# Altium project z80.PrjPcb
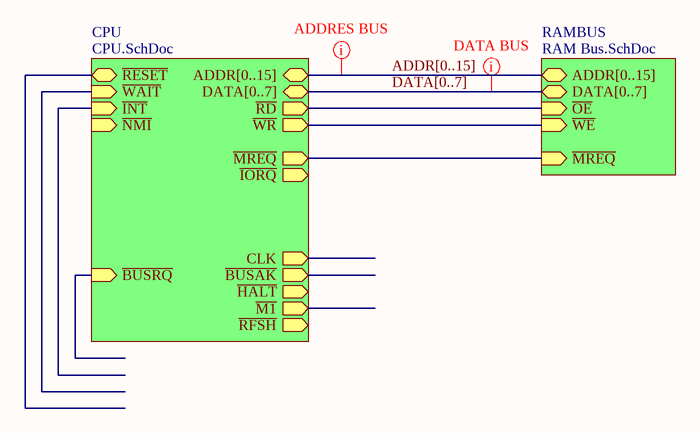
[diagram p0: main.SchDoc]
4 sheets, 54 parts. Net scope: hierarchical (ports join the sheet entries above them; power ports are global).
Board file: revA.PcbDoc
Sheets:
  main.SchDoc
    CPU = CPU.SchDoc
    RAMBUS = RAM Bus.SchDoc
      RAM = RAM.SchDoc
      RAM = RAM.SchDoc
      RAM = RAM.SchDoc
      RAM = RAM.SchDoc
      RAM = RAM.SchDoc
      RAM = RAM.SchDoc
      RAM = RAM.SchDoc
      RAM = RAM.SchDoc

## Sheet main.SchDoc
size A4; SheetNumber: 1

### Sub-sheets
CPU = CPU.SchDoc: ADDR[0..15] (bidir), DATA[0..7] (bidir), ~{M1} (out), ~{MREQ} (out), ~{IORQ} (out), ~{RD} (out), ~{WR} (out), ~{RFSH} (out), ~{WAIT} (in), ~{INT} (in), ~{BUSRQ} (in), ~{BUSAK} (out), ~{NMI} (in), ~{RESET} (bidir), ~{HALT} (out), CLK (out)
RAMBUS = RAM Bus.SchDoc: ~{OE} (in), ~{WE} (in), DATA[0..7] (bidir), ADDR[0..15] (bidir), ~{MREQ} (in)

### Nets
~{MREQ}: sheet CPU/~{MREQ}, sheet RAMBUS/~{MREQ}
~{RD}: sheet CPU/~{RD}, sheet RAMBUS/~{OE}
~{WR}: sheet CPU/~{WR}, sheet RAMBUS/~{WE}

### Buses and harness runs
bus ADDR[0..15] = sheet CPU/ADDR[0..15] = sheet RAMBUS/ADDR[0..15]
bus DATA[0..7] = sheet CPU/DATA[0..7] = sheet RAMBUS/DATA[0..7]

### Layout directives
net class ADDRES BUS: (no net found under the mark)
net class DATA BUS: (no net found under the mark)

## Sheet CPU.SchDoc
size A4; SheetNumber: 2
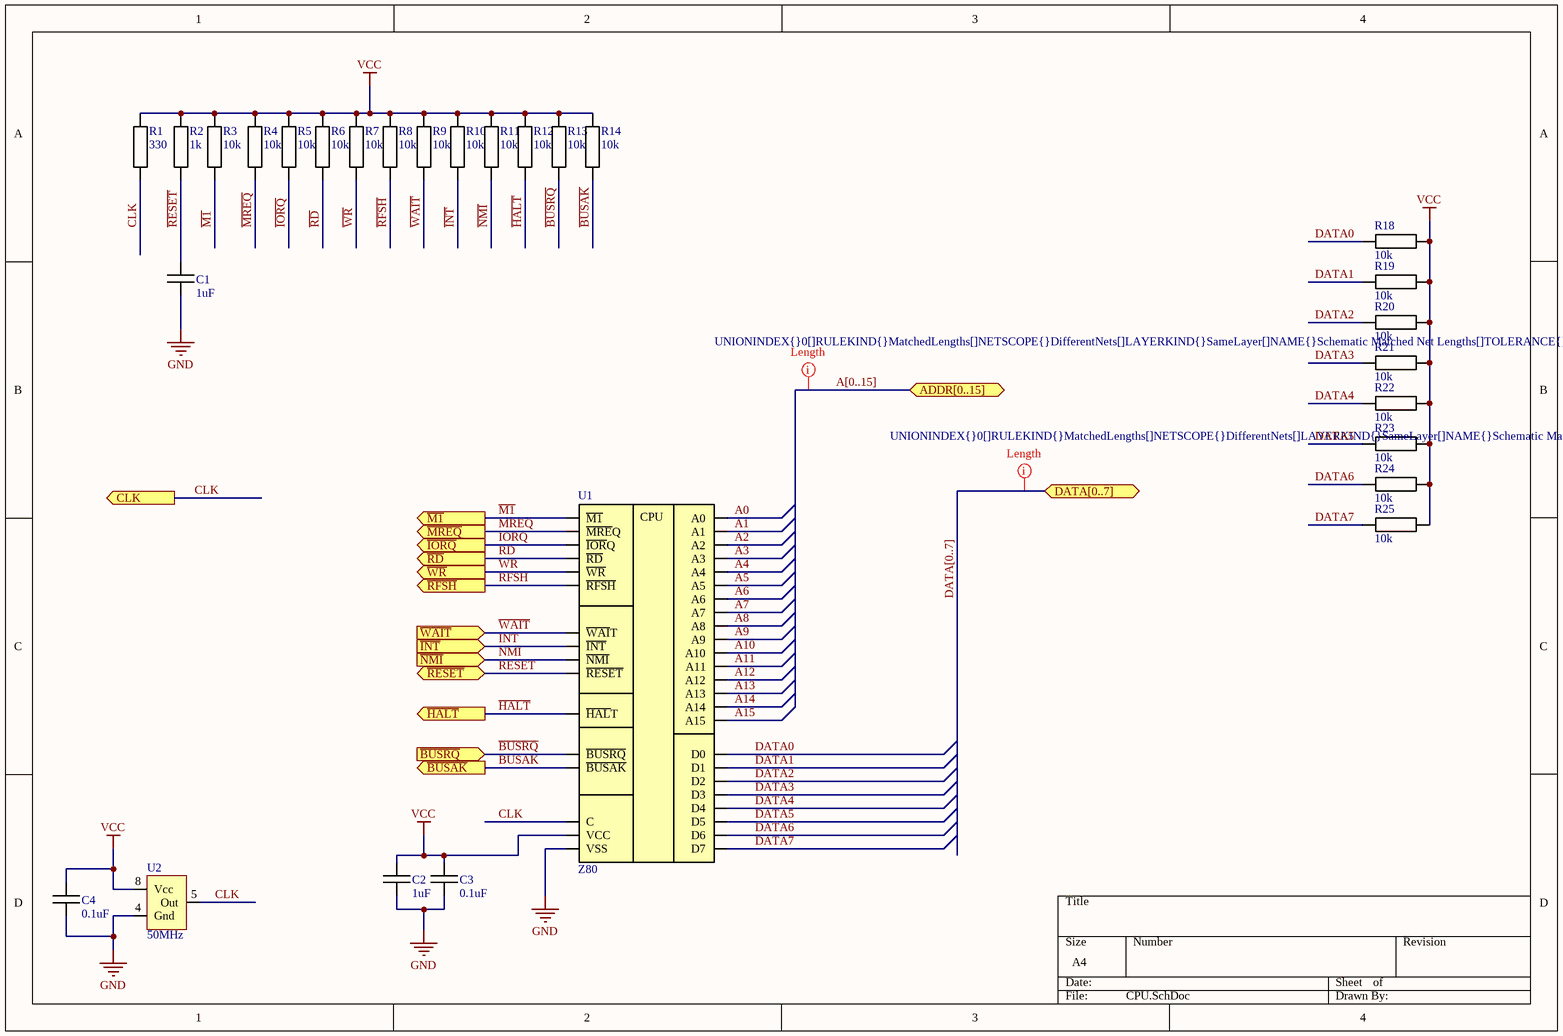
[diagram p1: CPU.SchDoc]

### Parts
C1  1uF  [SMD 0603]
C2  1uF  [SMD 0603]
C3  0.1uF  [SMD 0603]
C4  0.1uF  [SMD 0603]
R1  330  [SMD 0603]
R2  1k  [SMD 0603]
R3  10k  [SMD 0603]
R4  10k  [SMD 0603]
R5  10k  [SMD 0603]
R6  10k  [SMD 0603]
R7  10k  [SMD 0603]
R8  10k  [SMD 0603]
R9  10k  [SMD 0603]
R10  10k  [SMD 0603]
R11  10k  [SMD 0603]
R12  10k  [SMD 0603]
R13  10k  [SMD 0603]
R14  10k  [SMD 0603]
R18  10k  [SMD 0603]
R19  10k  [SMD 0603]
R20  10k  [SMD 0603]
R21  10k  [SMD 0603]
R22  10k  [SMD 0603]
R23  10k  [SMD 0603]
R24  10k  [SMD 0603]
R25  10k  [SMD 0603]
U1  Z80  [Z80]
U2  50MHz  [XTALL GEN]

### Ports
ADDR[0..15] (bidir), CLK (out), DATA[0..7] (bidir), ~{BUSAK} (out), ~{BUSRQ} (in), ~{HALT} (out), ~{INT} (in), ~{IORQ} (out), ~{M1} (out), ~{MREQ} (out), ~{NMI} (in), ~{RD} (out), ~{RESET} (bidir), ~{RFSH} (out), ~{WAIT} (in), ~{WR} (out)

### Nets
GND: C1.1 C2.1 C3.1 C4.1 U1.29(VSS) U2.4(Gnd)
VCC: C2.2 C3.2 C4.2 R1.2 R2.2 R3.2 R4.2 R5.2 R6.2 R7.2 R8.2 R9.2 R10.2 R11.2 R12.2 R13.2 R14.2 R18.2 R19.2 R20.2 R21.2 R22.2 R23.2 R24.2 R25.2 U1.11(VCC) U2.8(Vcc)
~{BUSAK}: R14.1 U1.23(~{BUSAK}) ; port ~{BUSAK}
~{BUSRQ}: R13.1 U1.25(~{BUSRQ}) ; port ~{BUSRQ}
~{HALT}: R12.1 U1.18(~{HAL}T) ; port ~{HALT}
~{INT}: R10.1 U1.16(~{INT}) ; port ~{INT}
~{IORQ}: R5.1 U1.20(~{IOR}Q) ; port ~{IORQ}
~{M1}: R3.1 U1.27(~{M1}) ; port ~{M1}
~{MREQ}: R4.1 U1.19(~{MRE}Q) ; port ~{MREQ}
~{NMI}: R11.1 U1.17(~{NMI}) ; port ~{NMI}
~{RD}: R6.1 U1.21(~{RD}) ; port ~{RD}
~{RESET}: C1.2 R2.1 U1.26(~{RESET}) ; port ~{RESET}
~{RFSH}: R8.1 U1.28(~{RFSH}) ; port ~{RFSH}
~{WAIT}: R9.1 U1.24(~{WAI}T) ; port ~{WAIT}
~{WR}: R7.1 U1.22(~{WR}) ; port ~{WR}
A0: U1.30(A0)  [project net ADDR0]
A1: U1.31(A1)  [project net ADDR1]
A2: U1.32(A2)  [project net ADDR2]
A3: U1.33(A3)  [project net ADDR3]
A4: U1.34(A4)  [project net ADDR4]
A5: U1.35(A5)  [project net ADDR5]
A6: U1.36(A6)  [project net ADDR6]
A7: U1.37(A7)  [project net ADDR7]
A8: U1.38(A8)  [project net ADDR8]
A9: U1.39(A9)  [project net ADDR9]
A10: U1.40(A10)  [project net ADDR10]
A11: U1.1(A11)  [project net ADDR11]
A12: U1.2(A12)  [project net ADDR12]
A13: U1.3(A13)  [project net ADDR13]
A14: U1.4(A14)  [project net ADDR14]
A15: U1.5(A15)  [project net ADDR15]
CLK: R1.1 U1.6(C) U2.5(Out) ; port CLK
DATA0: R18.1 U1.14(D0)
DATA1: R19.1 U1.15(D1)
DATA2: R20.1 U1.12(D2)
DATA3: R21.1 U1.8(D3)
DATA4: R22.1 U1.7(D4)
DATA5: R23.1 U1.9(D5)
DATA6: R24.1 U1.10(D6)
DATA7: R25.1 U1.13(D7)

### Buses and harness runs
bus A[0..15] = port ADDR[0..15]
bus DATA[0..7] = port DATA[0..7]

### Layout directives
rule Matched Net Lengths [Tolerance = 60mil]: (no net found under the mark)

### Notes on the sheet
- (in symbol Z80) CPU

### Library data of the parts
C1-C4 = Capasitor
  C1 C2: Value: 1uF
  C3 C4: Value: 0.1uF
R1-R14 R18-R25 = Resistor
  R1: Value: 330
  R2: Value: 1k
  R3-R14 R18-R25: Value: 10k
U1 = Z80: Zilog CPU
U2 = XTALL GEN: value: 50MHz

## Sheet RAM Bus.SchDoc
size A4; SheetNumber: 3
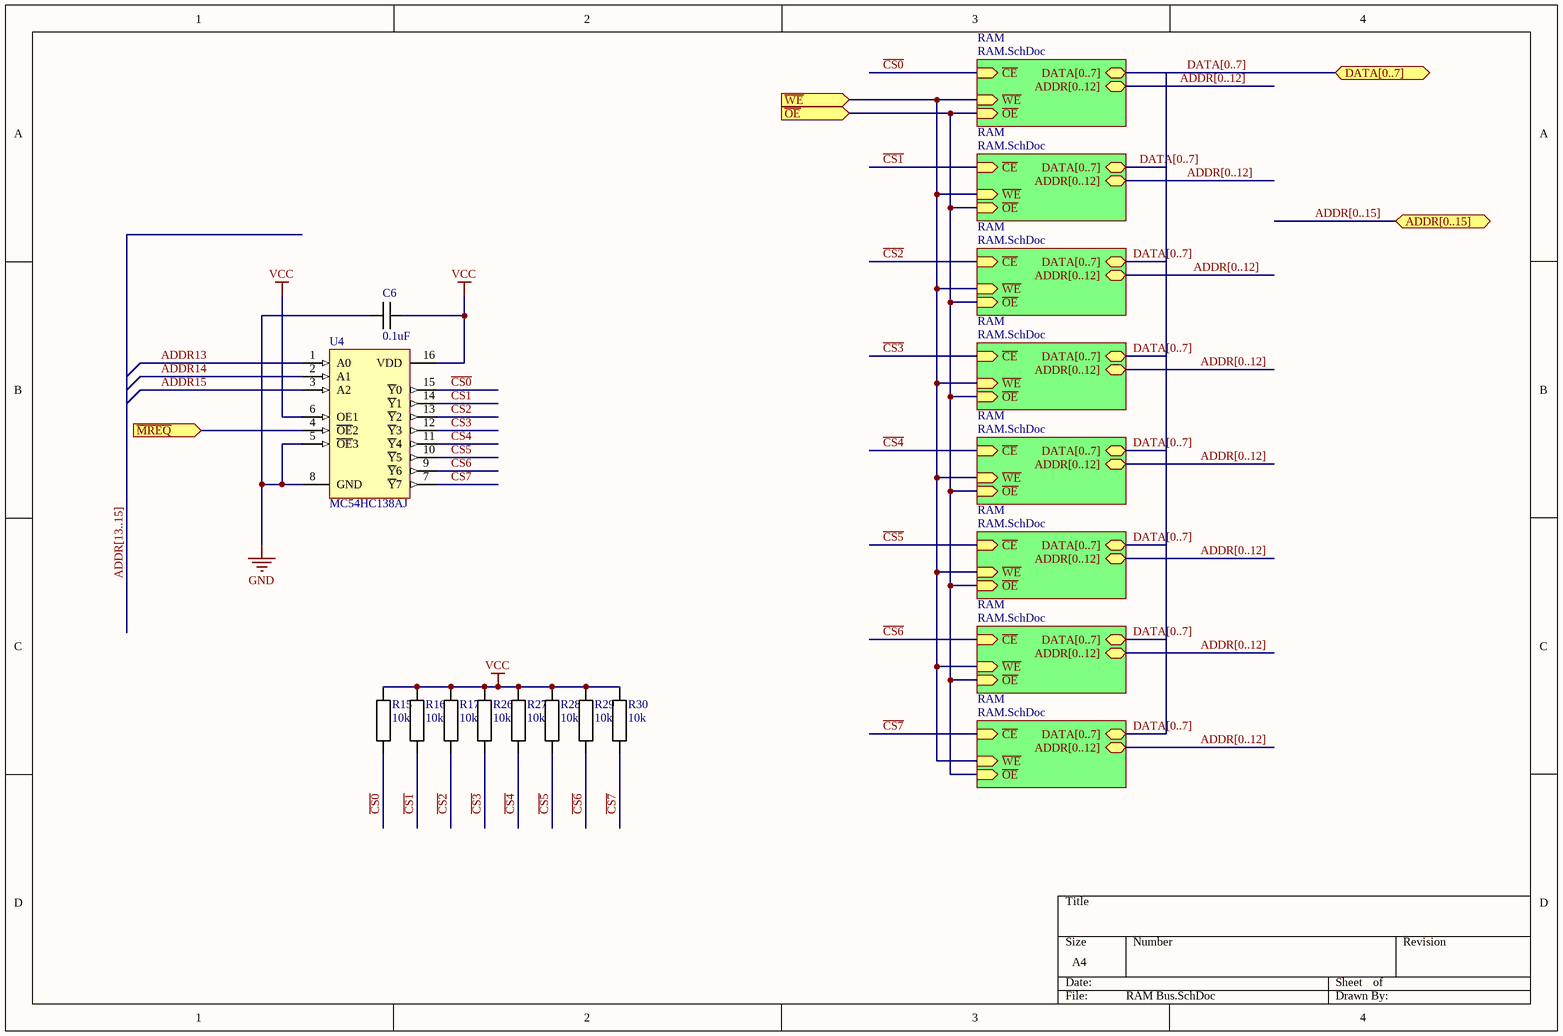
[diagram p2: RAM Bus.SchDoc]

### Parts
C6  0.1uF  [SMD 0603]
R15  10k  [SMD 0603]
R16  10k  [SMD 0603]
R17  10k  [SMD 0603]
R26  10k  [SMD 0603]
R27  10k  [SMD 0603]
R28  10k  [SMD 0603]
R29  10k  [SMD 0603]
R30  10k  [SMD 0603]
U4  MC54HC138AJ  [620-09]

### Sub-sheets
RAM = RAM.SchDoc: DATA[0..7] (bidir), ADDR[0..12] (bidir), ~{WE} (in), ~{CE} (in), ~{OE} (in)
RAM = RAM.SchDoc: DATA[0..7] (bidir), ADDR[0..12] (bidir), ~{WE} (in), ~{CE} (in), ~{OE} (in)
RAM = RAM.SchDoc: DATA[0..7] (bidir), ADDR[0..12] (bidir), ~{WE} (in), ~{CE} (in), ~{OE} (in)
RAM = RAM.SchDoc: DATA[0..7] (bidir), ADDR[0..12] (bidir), ~{WE} (in), ~{CE} (in), ~{OE} (in)
RAM = RAM.SchDoc: DATA[0..7] (bidir), ADDR[0..12] (bidir), ~{WE} (in), ~{CE} (in), ~{OE} (in)
RAM = RAM.SchDoc: DATA[0..7] (bidir), ADDR[0..12] (bidir), ~{WE} (in), ~{CE} (in), ~{OE} (in)
RAM = RAM.SchDoc: DATA[0..7] (bidir), ADDR[0..12] (bidir), ~{WE} (in), ~{CE} (in), ~{OE} (in)
RAM = RAM.SchDoc: DATA[0..7] (bidir), ADDR[0..12] (bidir), ~{WE} (in), ~{CE} (in), ~{OE} (in)

### Ports
ADDR[0..15] (bidir), DATA[0..7] (bidir), ~{MREQ} (in), ~{OE} (in), ~{WE} (in)

### Nets
GND: C6.1 U4.5(~{OE}3) U4.8(GND)
VCC: C6.2 R15.2 R16.2 R17.2 R26.2 R27.2 R28.2 R29.2 R30.2 U4.6(OE1) U4.16(VDD)
~{CS0}: R15.1 U4.15(~{Y}0) ; sheet RAM/~{CE}
~{CS1}: R16.1 U4.14(~{Y}1) ; sheet RAM/~{CE}
~{CS2}: R17.1 U4.13(~{Y}2) ; sheet RAM/~{CE}
~{CS3}: R26.1 U4.12(~{Y}3) ; sheet RAM/~{CE}
~{CS4}: R27.1 U4.11(~{Y}4) ; sheet RAM/~{CE}
~{CS5}: R28.1 U4.10(~{Y}5) ; sheet RAM/~{CE}
~{CS6}: R29.1 U4.9(~{Y}6) ; sheet RAM/~{CE}
~{CS7}: R30.1 U4.7(~{Y}7) ; sheet RAM/~{CE}
~{MREQ}: U4.4(~{OE}2) ; port ~{MREQ}
~{RD}: port ~{OE}, sheet RAM/~{OE}, sheet RAM/~{OE}, sheet RAM/~{OE}, sheet RAM/~{OE}, sheet RAM/~{OE}, sheet RAM/~{OE}, sheet RAM/~{OE}, sheet RAM/~{OE}
~{WR}: port ~{WE}, sheet RAM/~{WE}, sheet RAM/~{WE}, sheet RAM/~{WE}, sheet RAM/~{WE}, sheet RAM/~{WE}, sheet RAM/~{WE}, sheet RAM/~{WE}, sheet RAM/~{WE}
ADDR13: U4.1(A0)
ADDR14: U4.2(A1)
ADDR15: U4.3(A2)

### Buses and harness runs
bus ADDR[0..12] = sheet RAM/ADDR[0..12]
bus ADDR[0..15] = port ADDR[0..15]
bus ADDR[13..15]
bus DATA[0..7] = port DATA[0..7] = sheet RAM/DATA[0..7]

### Library data of the parts
C6 = Capasitor: Value: 0.1uF
R15-R17 R26-R30 = Resistor: Value: 10k
U4 = MC54HC138AJ: 1-of-8 Decoder/Demultiplexer; Published: 17-Jul-2002; LatestRevisionDate: 06-Jun-2005; LatestRevisionNote: Stylized 3D Model Added; DatasheetVersion: 1989; PackageReference: 620-09; Publisher: Altium Limited; PackageDescription: DIP; 16 Leads; Row Spacing 7.62 mm; Pitch 2.54 mm; Code_JEDEC: MS-001-BB; ComponentLink1Description: Manufacturer Link; ComponentLink1URL: http://www.onsemi.com/site/products/parametrics/0,4446,419,00.html; ComponentLink2Description: Datasheet; ComponentLink2URL: http://www.onsemi.com/pub/Collateral/MC74HC138A-D.PDF

## Sheet RAM.SchDoc
size A4; SheetNumber: 4
Used 8 times, as channels RAMBUS/RAM, RAMBUS/RAM, RAMBUS/RAM, RAMBUS/RAM, RAMBUS/RAM, RAMBUS/RAM, RAMBUS/RAM, RAMBUS/RAM. Parts and nets are listed once, with the designators drawn on the sheet.
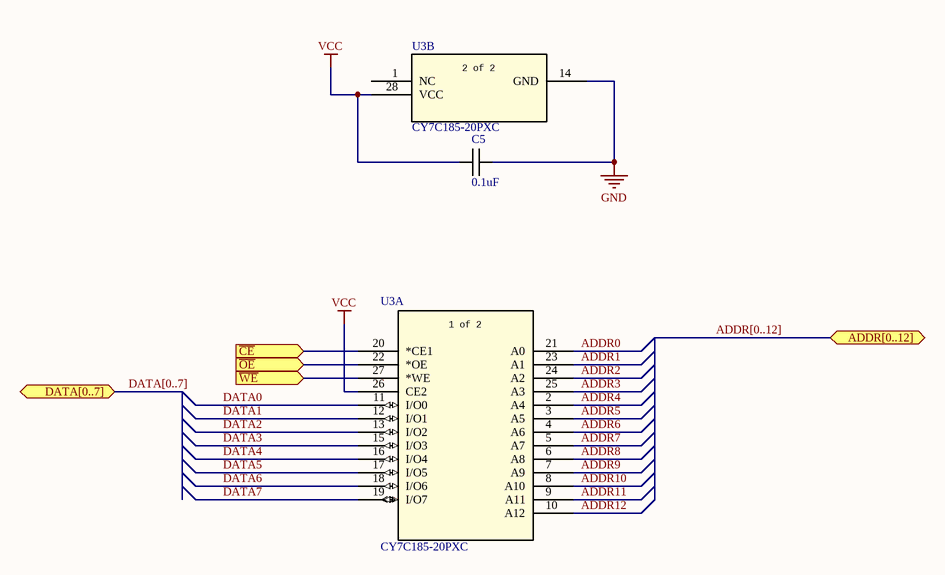
[diagram p3: RAM.SchDoc]

### Parts
C5  0.1uF  [SMD 0603]
U3  CY7C185-20PXC  [DIP-28]  (parts A,B of 2)

### Ports
ADDR[0..12] (bidir), DATA[0..7] (bidir), ~{CE} (in), ~{OE} (in), ~{WE} (in)

### Nets
GND: C5.2 U3.14(GND)
VCC: C5.1 U3.26(CE2) U3.28(VCC)
~{CE}: U3.20(*CE1) ; port ~{CE}
~{OE}: U3.22(*OE) ; port ~{OE}
~{WE}: U3.27(*WE) ; port ~{WE}
ADDR0: U3.21(A0)
ADDR1: U3.23(A1)
ADDR2: U3.24(A2)
ADDR3: U3.25(A3)
ADDR4: U3.2(A4)
ADDR5: U3.3(A5)
ADDR6: U3.4(A6)
ADDR7: U3.5(A7)
ADDR8: U3.6(A8)
ADDR9: U3.7(A9)
ADDR10: U3.8(A10)
ADDR11: U3.9(A11)
ADDR12: U3.10(A12)
DATA0: U3.11(I/O0)
DATA1: U3.12(I/O1)
DATA2: U3.13(I/O2)
DATA3: U3.15(I/O3)
DATA4: U3.16(I/O4)
DATA5: U3.17(I/O5)
DATA6: U3.18(I/O6)
DATA7: U3.19(I/O7)

Not connected (* = marked no-connect by the designer): U3 1(NC)

### Channels
RAMBUS/RAM: designators C5=C8.5 U3=U8.3; ports ~{CE}=~{CS0} ~{OE}=~{RD} ~{WE}=~{WR}
RAMBUS/RAM: designators C5=C7.5 U3=U7.3; ports ~{CE}=~{CS1} ~{OE}=~{RD} ~{WE}=~{WR}
RAMBUS/RAM: designators C5=C6.5 U3=U6.3; ports ~{CE}=~{CS2} ~{OE}=~{RD} ~{WE}=~{WR}
RAMBUS/RAM: designators C5=C5.5 U3=U5.3; ports ~{CE}=~{CS3} ~{OE}=~{RD} ~{WE}=~{WR}
RAMBUS/RAM: designators C5=C4.5 U3=U4.3; ports ~{CE}=~{CS4} ~{OE}=~{RD} ~{WE}=~{WR}
RAMBUS/RAM: designators C5=C3.5 U3=U3.3; ports ~{CE}=~{CS5} ~{OE}=~{RD} ~{WE}=~{WR}
RAMBUS/RAM: designators C5=C2.5 U3=U2.3; ports ~{CE}=~{CS6} ~{OE}=~{RD} ~{WE}=~{WR}
RAMBUS/RAM: designators C5=C1.5 U3=U1.3; ports ~{CE}=~{CS7} ~{OE}=~{RD} ~{WE}=~{WR}

### Buses and harness runs
bus ADDR[0..12] = port ADDR[0..12]
bus DATA[0..7] = port DATA[0..7]

### Notes on the sheet
- (in symbol CY7C185-20PXC, part A) 1 of 2
- (in symbol CY7C185-20PXC, part B) 2 of 2

### Library data of the parts
C5 = Capasitor: Value: 0.1uF
U3 = CY7C185-20PXC: IC SRAM 64KBIT 20NS 28DIP; Built_By: EMA_UL_Team; Vendor: Cypress Semiconductor; Manufacturer_Part_Number: CY7C185-20PXC; RefDes: RefDes; Type: DEV; Value: Value

## Nets that join several sheets
GND: CPU (6 pins), RAM Bus (C6.1 U4.5 U4.8), RAMBUS/RAM (C8.5.2 U8.3.14), RAMBUS/RAM (C7.5.2 U7.3.14), RAMBUS/RAM (C6.5.2 U6.3.14), RAMBUS/RAM (C5.5.2 U5.3.14), RAMBUS/RAM (C4.5.2 U4.3.14), RAMBUS/RAM (C3.5.2 U3.3.14), RAMBUS/RAM (C2.5.2 U2.3.14), RAMBUS/RAM (C1.5.2 U1.3.14)
VCC: CPU (27 pins), RAM Bus (11 pins), RAMBUS/RAM (C8.5.1 U8.3.26 U8.3.28), RAMBUS/RAM (C7.5.1 U7.3.26 U7.3.28), RAMBUS/RAM (C6.5.1 U6.3.26 U6.3.28), RAMBUS/RAM (C5.5.1 U5.3.26 U5.3.28), RAMBUS/RAM (C4.5.1 U4.3.26 U4.3.28), RAMBUS/RAM (C3.5.1 U3.3.26 U3.3.28), RAMBUS/RAM (C2.5.1 U2.3.26 U2.3.28), RAMBUS/RAM (C1.5.1 U1.3.26 U1.3.28)
~{CS0}: RAM Bus (R15.1 U4.15), RAMBUS/RAM (U8.3.20)
~{CS1}: RAM Bus (R16.1 U4.14), RAMBUS/RAM (U7.3.20)
~{CS2}: RAM Bus (R17.1 U4.13), RAMBUS/RAM (U6.3.20)
~{CS3}: RAM Bus (R26.1 U4.12), RAMBUS/RAM (U5.3.20)
~{CS4}: RAM Bus (R27.1 U4.11), RAMBUS/RAM (U4.3.20)
~{CS5}: RAM Bus (R28.1 U4.10), RAMBUS/RAM (U3.3.20)
~{CS6}: RAM Bus (R29.1 U4.9), RAMBUS/RAM (U2.3.20)
~{CS7}: RAM Bus (R30.1 U4.7), RAMBUS/RAM (U1.3.20)
~{MREQ}: CPU (R4.1 U1.19), RAM Bus (U4.4)
~{RD}: CPU (R6.1 U1.21), RAMBUS/RAM (U8.3.22), RAMBUS/RAM (U7.3.22), RAMBUS/RAM (U6.3.22), RAMBUS/RAM (U5.3.22), RAMBUS/RAM (U4.3.22), RAMBUS/RAM (U3.3.22), RAMBUS/RAM (U2.3.22), RAMBUS/RAM (U1.3.22)
~{WR}: CPU (R7.1 U1.22), RAMBUS/RAM (U8.3.27), RAMBUS/RAM (U7.3.27), RAMBUS/RAM (U6.3.27), RAMBUS/RAM (U5.3.27), RAMBUS/RAM (U4.3.27), RAMBUS/RAM (U3.3.27), RAMBUS/RAM (U2.3.27), RAMBUS/RAM (U1.3.27)
ADDR0: CPU (U1.30), RAMBUS/RAM (U8.3.21), RAMBUS/RAM (U7.3.21), RAMBUS/RAM (U6.3.21), RAMBUS/RAM (U5.3.21), RAMBUS/RAM (U4.3.21), RAMBUS/RAM (U3.3.21), RAMBUS/RAM (U2.3.21), RAMBUS/RAM (U1.3.21)
ADDR1: CPU (U1.31), RAMBUS/RAM (U8.3.23), RAMBUS/RAM (U7.3.23), RAMBUS/RAM (U6.3.23), RAMBUS/RAM (U5.3.23), RAMBUS/RAM (U4.3.23), RAMBUS/RAM (U3.3.23), RAMBUS/RAM (U2.3.23), RAMBUS/RAM (U1.3.23)
ADDR2: CPU (U1.32), RAMBUS/RAM (U8.3.24), RAMBUS/RAM (U7.3.24), RAMBUS/RAM (U6.3.24), RAMBUS/RAM (U5.3.24), RAMBUS/RAM (U4.3.24), RAMBUS/RAM (U3.3.24), RAMBUS/RAM (U2.3.24), RAMBUS/RAM (U1.3.24)
ADDR3: CPU (U1.33), RAMBUS/RAM (U8.3.25), RAMBUS/RAM (U7.3.25), RAMBUS/RAM (U6.3.25), RAMBUS/RAM (U5.3.25), RAMBUS/RAM (U4.3.25), RAMBUS/RAM (U3.3.25), RAMBUS/RAM (U2.3.25), RAMBUS/RAM (U1.3.25)
ADDR4: CPU (U1.34), RAMBUS/RAM (U8.3.2), RAMBUS/RAM (U7.3.2), RAMBUS/RAM (U6.3.2), RAMBUS/RAM (U5.3.2), RAMBUS/RAM (U4.3.2), RAMBUS/RAM (U3.3.2), RAMBUS/RAM (U2.3.2), RAMBUS/RAM (U1.3.2)
ADDR5: CPU (U1.35), RAMBUS/RAM (U8.3.3), RAMBUS/RAM (U7.3.3), RAMBUS/RAM (U6.3.3), RAMBUS/RAM (U5.3.3), RAMBUS/RAM (U4.3.3), RAMBUS/RAM (U3.3.3), RAMBUS/RAM (U2.3.3), RAMBUS/RAM (U1.3.3)
ADDR6: CPU (U1.36), RAMBUS/RAM (U8.3.4), RAMBUS/RAM (U7.3.4), RAMBUS/RAM (U6.3.4), RAMBUS/RAM (U5.3.4), RAMBUS/RAM (U4.3.4), RAMBUS/RAM (U3.3.4), RAMBUS/RAM (U2.3.4), RAMBUS/RAM (U1.3.4)
ADDR7: CPU (U1.37), RAMBUS/RAM (U8.3.5), RAMBUS/RAM (U7.3.5), RAMBUS/RAM (U6.3.5), RAMBUS/RAM (U5.3.5), RAMBUS/RAM (U4.3.5), RAMBUS/RAM (U3.3.5), RAMBUS/RAM (U2.3.5), RAMBUS/RAM (U1.3.5)
ADDR8: CPU (U1.38), RAMBUS/RAM (U8.3.6), RAMBUS/RAM (U7.3.6), RAMBUS/RAM (U6.3.6), RAMBUS/RAM (U5.3.6), RAMBUS/RAM (U4.3.6), RAMBUS/RAM (U3.3.6), RAMBUS/RAM (U2.3.6), RAMBUS/RAM (U1.3.6)
ADDR9: CPU (U1.39), RAMBUS/RAM (U8.3.7), RAMBUS/RAM (U7.3.7), RAMBUS/RAM (U6.3.7), RAMBUS/RAM (U5.3.7), RAMBUS/RAM (U4.3.7), RAMBUS/RAM (U3.3.7), RAMBUS/RAM (U2.3.7), RAMBUS/RAM (U1.3.7)
ADDR10: CPU (U1.40), RAMBUS/RAM (U8.3.8), RAMBUS/RAM (U7.3.8), RAMBUS/RAM (U6.3.8), RAMBUS/RAM (U5.3.8), RAMBUS/RAM (U4.3.8), RAMBUS/RAM (U3.3.8), RAMBUS/RAM (U2.3.8), RAMBUS/RAM (U1.3.8)
ADDR11: CPU (U1.1), RAMBUS/RAM (U8.3.9), RAMBUS/RAM (U7.3.9), RAMBUS/RAM (U6.3.9), RAMBUS/RAM (U5.3.9), RAMBUS/RAM (U4.3.9), RAMBUS/RAM (U3.3.9), RAMBUS/RAM (U2.3.9), RAMBUS/RAM (U1.3.9)
ADDR12: CPU (U1.2), RAMBUS/RAM (U8.3.10), RAMBUS/RAM (U7.3.10), RAMBUS/RAM (U6.3.10), RAMBUS/RAM (U5.3.10), RAMBUS/RAM (U4.3.10), RAMBUS/RAM (U3.3.10), RAMBUS/RAM (U2.3.10), RAMBUS/RAM (U1.3.10)
ADDR13: CPU (U1.3), RAM Bus (U4.1)
ADDR14: CPU (U1.4), RAM Bus (U4.2)
ADDR15: CPU (U1.5), RAM Bus (U4.3)
DATA0: CPU (R18.1 U1.14), RAMBUS/RAM (U8.3.11), RAMBUS/RAM (U7.3.11), RAMBUS/RAM (U6.3.11), RAMBUS/RAM (U5.3.11), RAMBUS/RAM (U4.3.11), RAMBUS/RAM (U3.3.11), RAMBUS/RAM (U2.3.11), RAMBUS/RAM (U1.3.11)
DATA1: CPU (R19.1 U1.15), RAMBUS/RAM (U8.3.12), RAMBUS/RAM (U7.3.12), RAMBUS/RAM (U6.3.12), RAMBUS/RAM (U5.3.12), RAMBUS/RAM (U4.3.12), RAMBUS/RAM (U3.3.12), RAMBUS/RAM (U2.3.12), RAMBUS/RAM (U1.3.12)
DATA2: CPU (R20.1 U1.12), RAMBUS/RAM (U8.3.13), RAMBUS/RAM (U7.3.13), RAMBUS/RAM (U6.3.13), RAMBUS/RAM (U5.3.13), RAMBUS/RAM (U4.3.13), RAMBUS/RAM (U3.3.13), RAMBUS/RAM (U2.3.13), RAMBUS/RAM (U1.3.13)
DATA3: CPU (R21.1 U1.8), RAMBUS/RAM (U8.3.15), RAMBUS/RAM (U7.3.15), RAMBUS/RAM (U6.3.15), RAMBUS/RAM (U5.3.15), RAMBUS/RAM (U4.3.15), RAMBUS/RAM (U3.3.15), RAMBUS/RAM (U2.3.15), RAMBUS/RAM (U1.3.15)
DATA4: CPU (R22.1 U1.7), RAMBUS/RAM (U8.3.16), RAMBUS/RAM (U7.3.16), RAMBUS/RAM (U6.3.16), RAMBUS/RAM (U5.3.16), RAMBUS/RAM (U4.3.16), RAMBUS/RAM (U3.3.16), RAMBUS/RAM (U2.3.16), RAMBUS/RAM (U1.3.16)
DATA5: CPU (R23.1 U1.9), RAMBUS/RAM (U8.3.17), RAMBUS/RAM (U7.3.17), RAMBUS/RAM (U6.3.17), RAMBUS/RAM (U5.3.17), RAMBUS/RAM (U4.3.17), RAMBUS/RAM (U3.3.17), RAMBUS/RAM (U2.3.17), RAMBUS/RAM (U1.3.17)
DATA6: CPU (R24.1 U1.10), RAMBUS/RAM (U8.3.18), RAMBUS/RAM (U7.3.18), RAMBUS/RAM (U6.3.18), RAMBUS/RAM (U5.3.18), RAMBUS/RAM (U4.3.18), RAMBUS/RAM (U3.3.18), RAMBUS/RAM (U2.3.18), RAMBUS/RAM (U1.3.18)
DATA7: CPU (R25.1 U1.13), RAMBUS/RAM (U8.3.19), RAMBUS/RAM (U7.3.19), RAMBUS/RAM (U6.3.19), RAMBUS/RAM (U5.3.19), RAMBUS/RAM (U4.3.19), RAMBUS/RAM (U3.3.19), RAMBUS/RAM (U2.3.19), RAMBUS/RAM (U1.3.19)